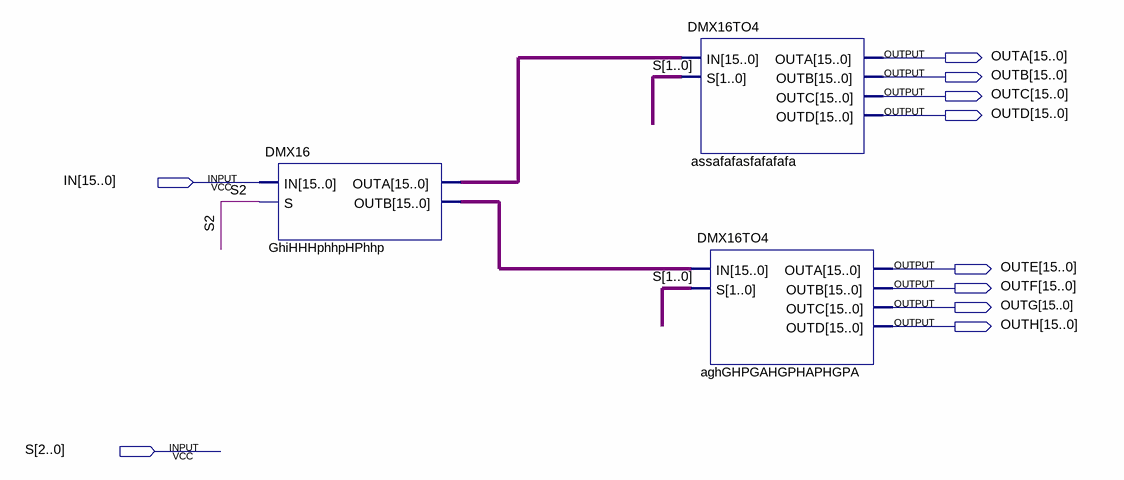
[diagram p0: schematic sheet]
// Quartus schematic DMX16TO8.bdf as structural Verilog: 3 symbols, 10 pins
module DMX16TO8 (
  input  [15:0] IN,
  input  [2:0] S,
  output [15:0] OUTA,
  output [15:0] OUTB,
  output [15:0] OUTC,
  output [15:0] OUTD,
  output [15:0] OUTE,
  output [15:0] OUTF,
  output [15:0] OUTG,
  output [15:0] OUTH
);

  wire [15:0] GhiHHHphhpHPhhp_outa, GhiHHHphhpHPhhp_outb;

  DMX16 GhiHHHphhpHPhhp (.IN(IN), .S(S[2]), .OUTA(GhiHHHphhpHPhhp_outa), .OUTB(GhiHHHphhpHPhhp_outb));
  DMX16TO4 assafafasfafafafa (
    .IN(GhiHHHphhpHPhhp_outa), .S(S[1:0]), .OUTA(OUTA), .OUTB(OUTB), .OUTC(OUTC), .OUTD(OUTD));
  DMX16TO4 aghGHPGAHGPHAPHGPA (
    .IN(GhiHHHphhpHPhhp_outb), .S(S[1:0]), .OUTA(OUTE), .OUTB(OUTF), .OUTC(OUTG), .OUTD(OUTH));
endmodule
